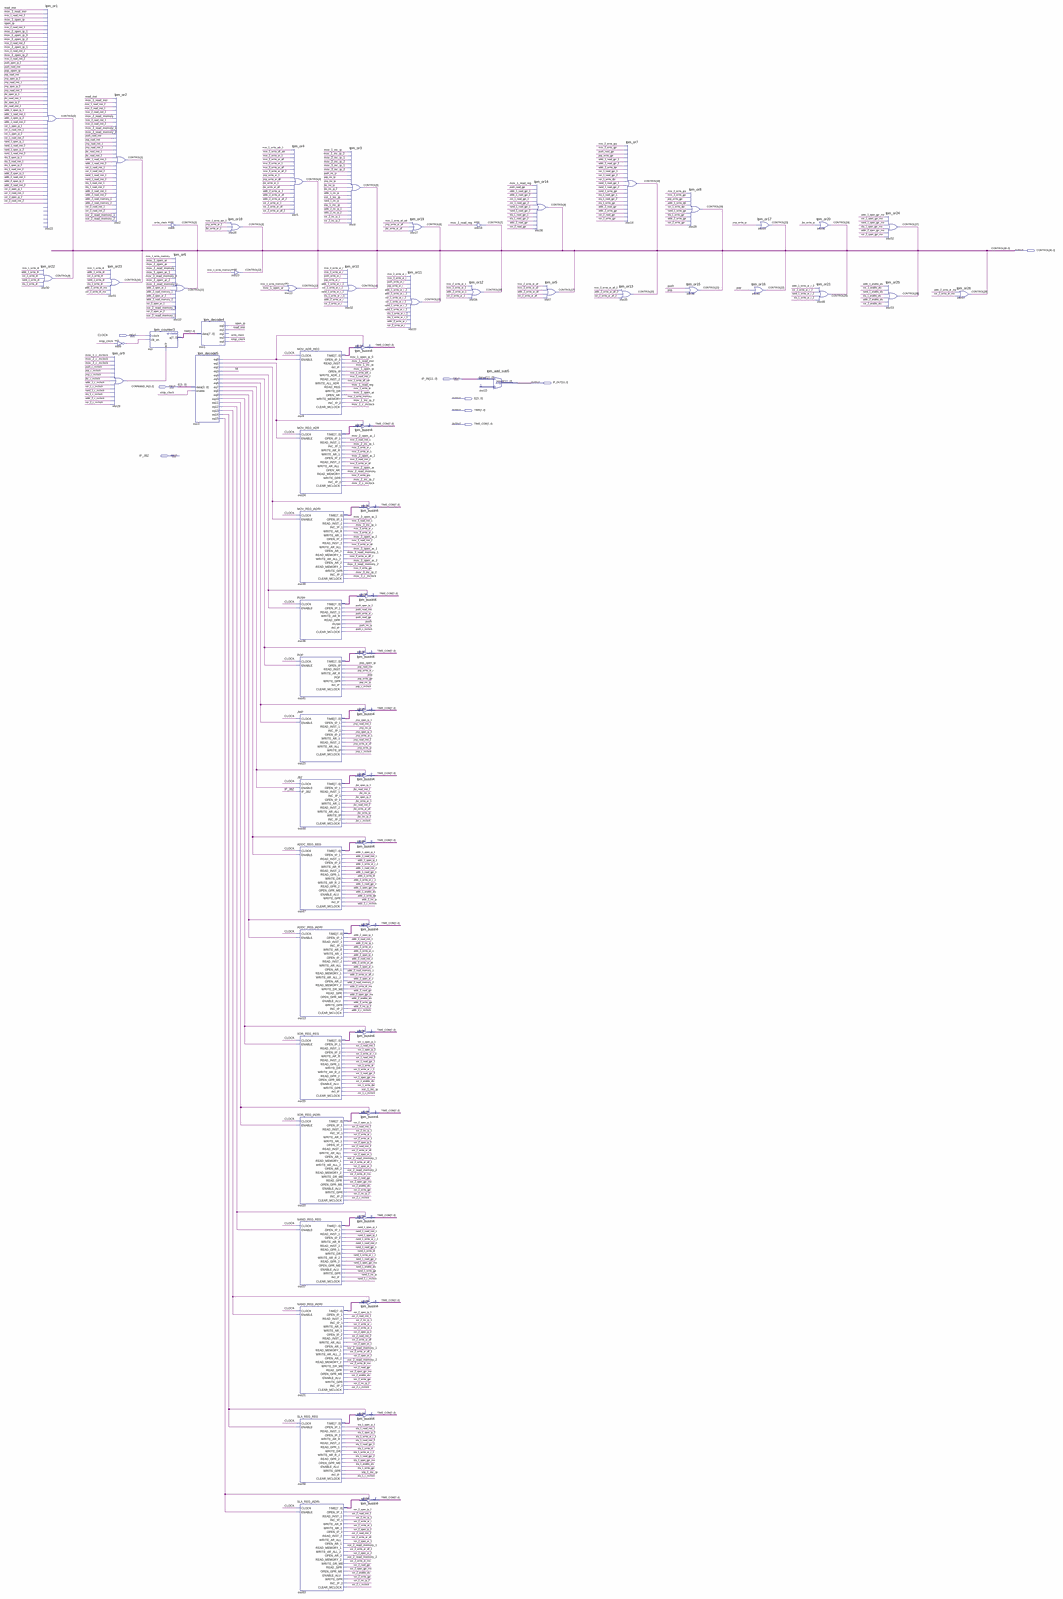
[diagram p0: schematic sheet, whole]
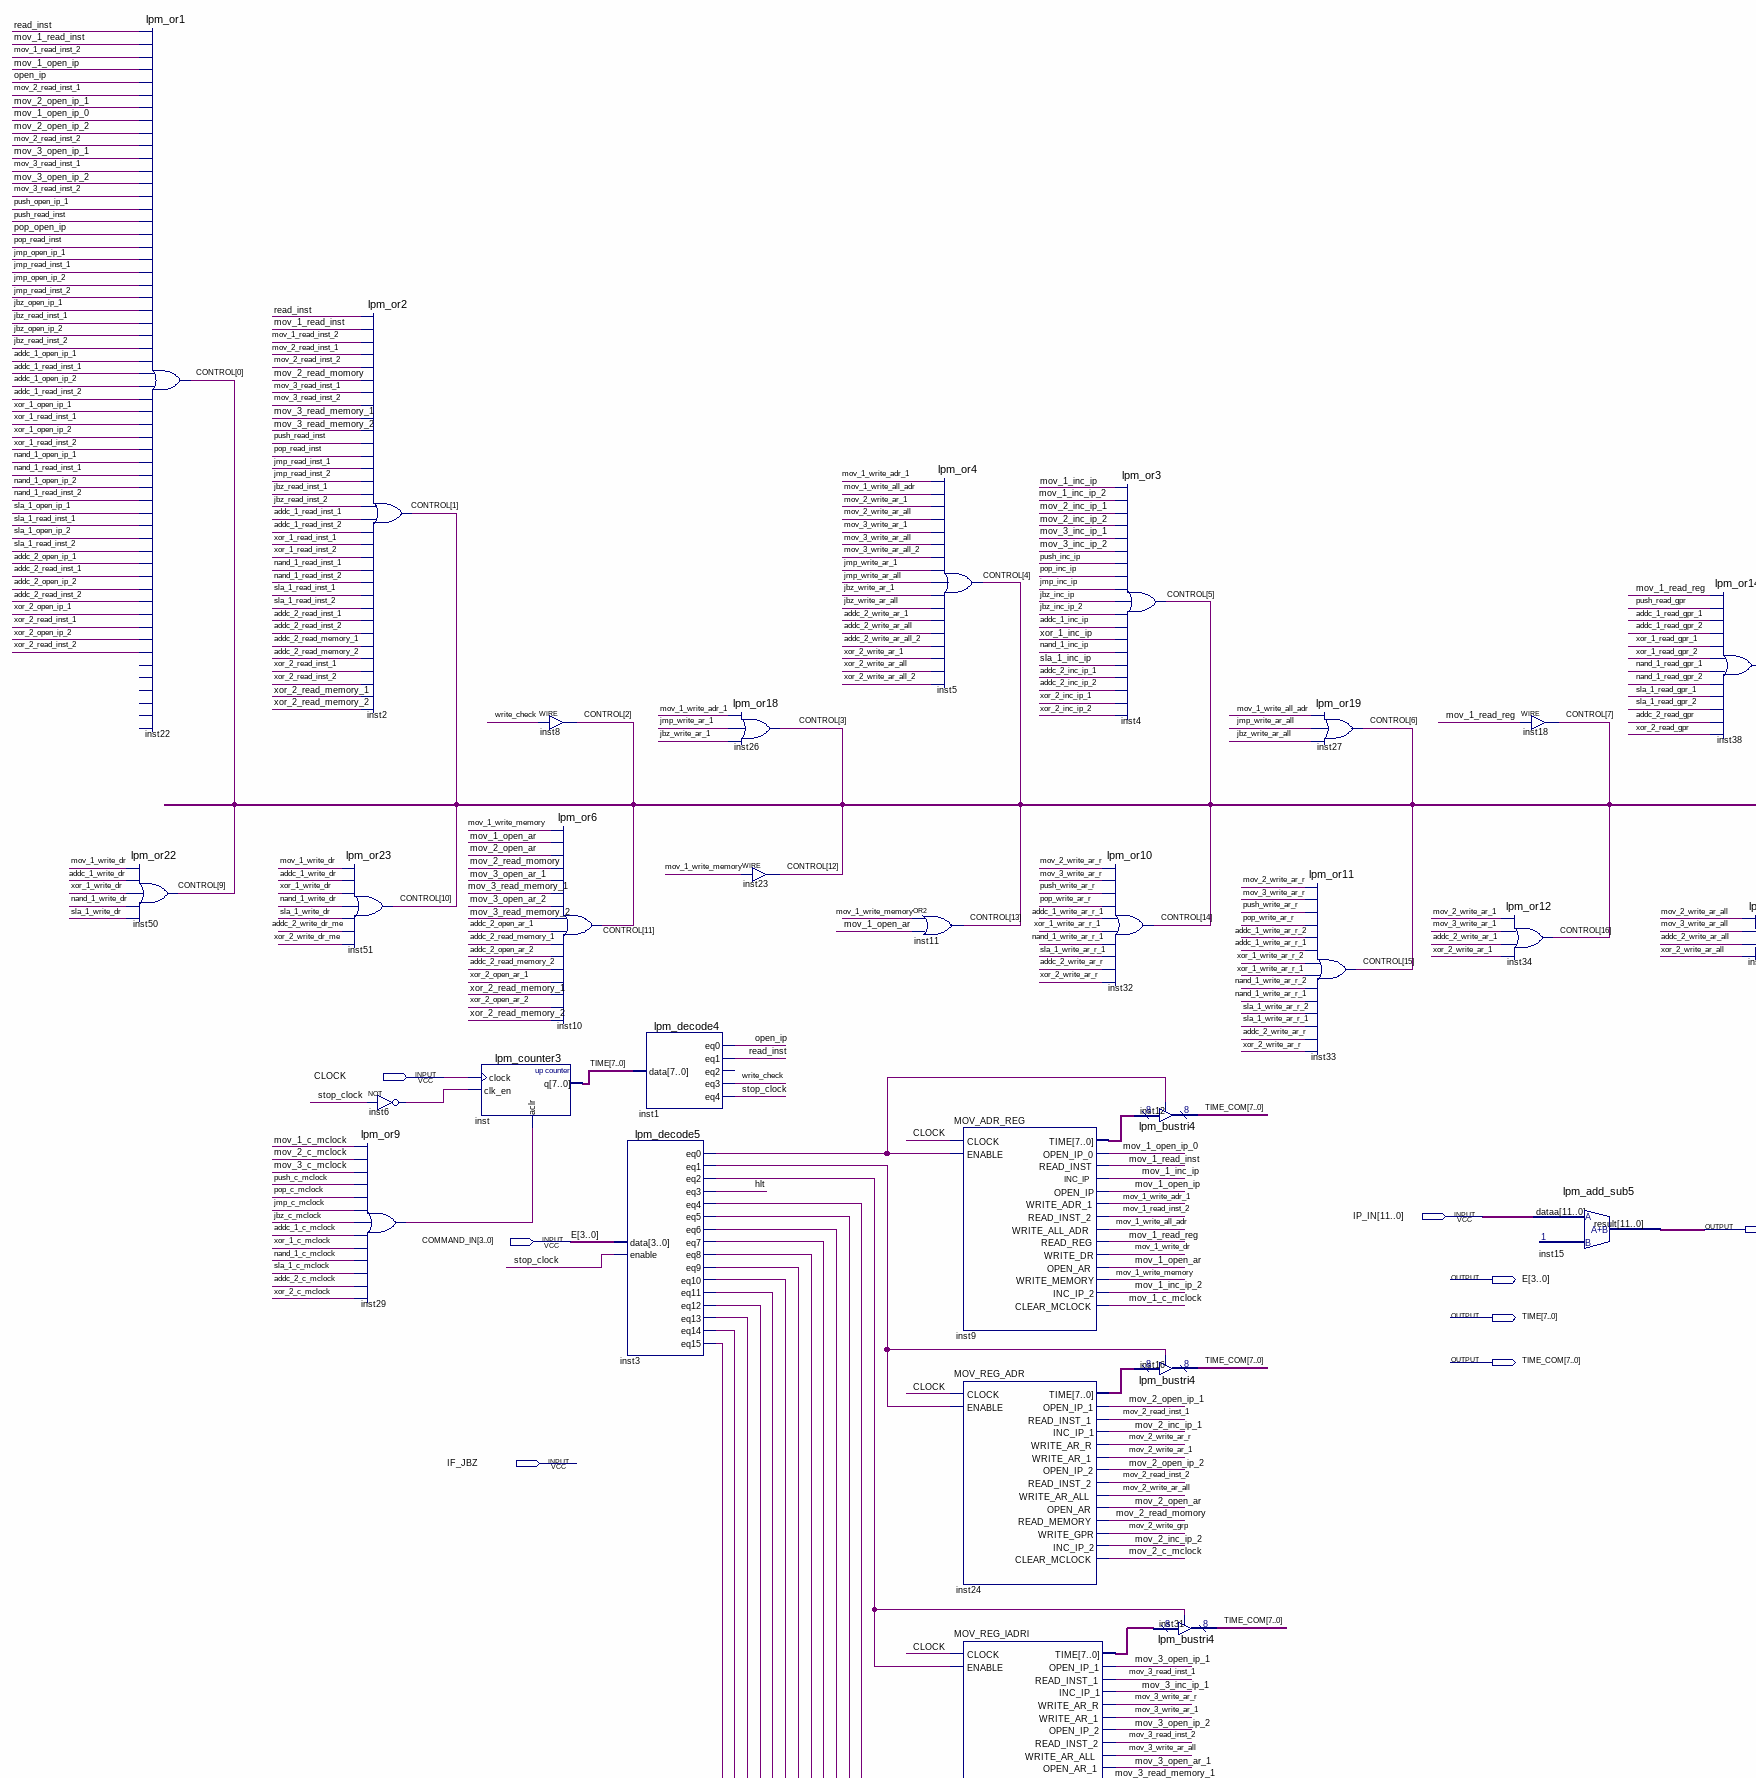
[diagram p1: schematic sheet, upper left part]
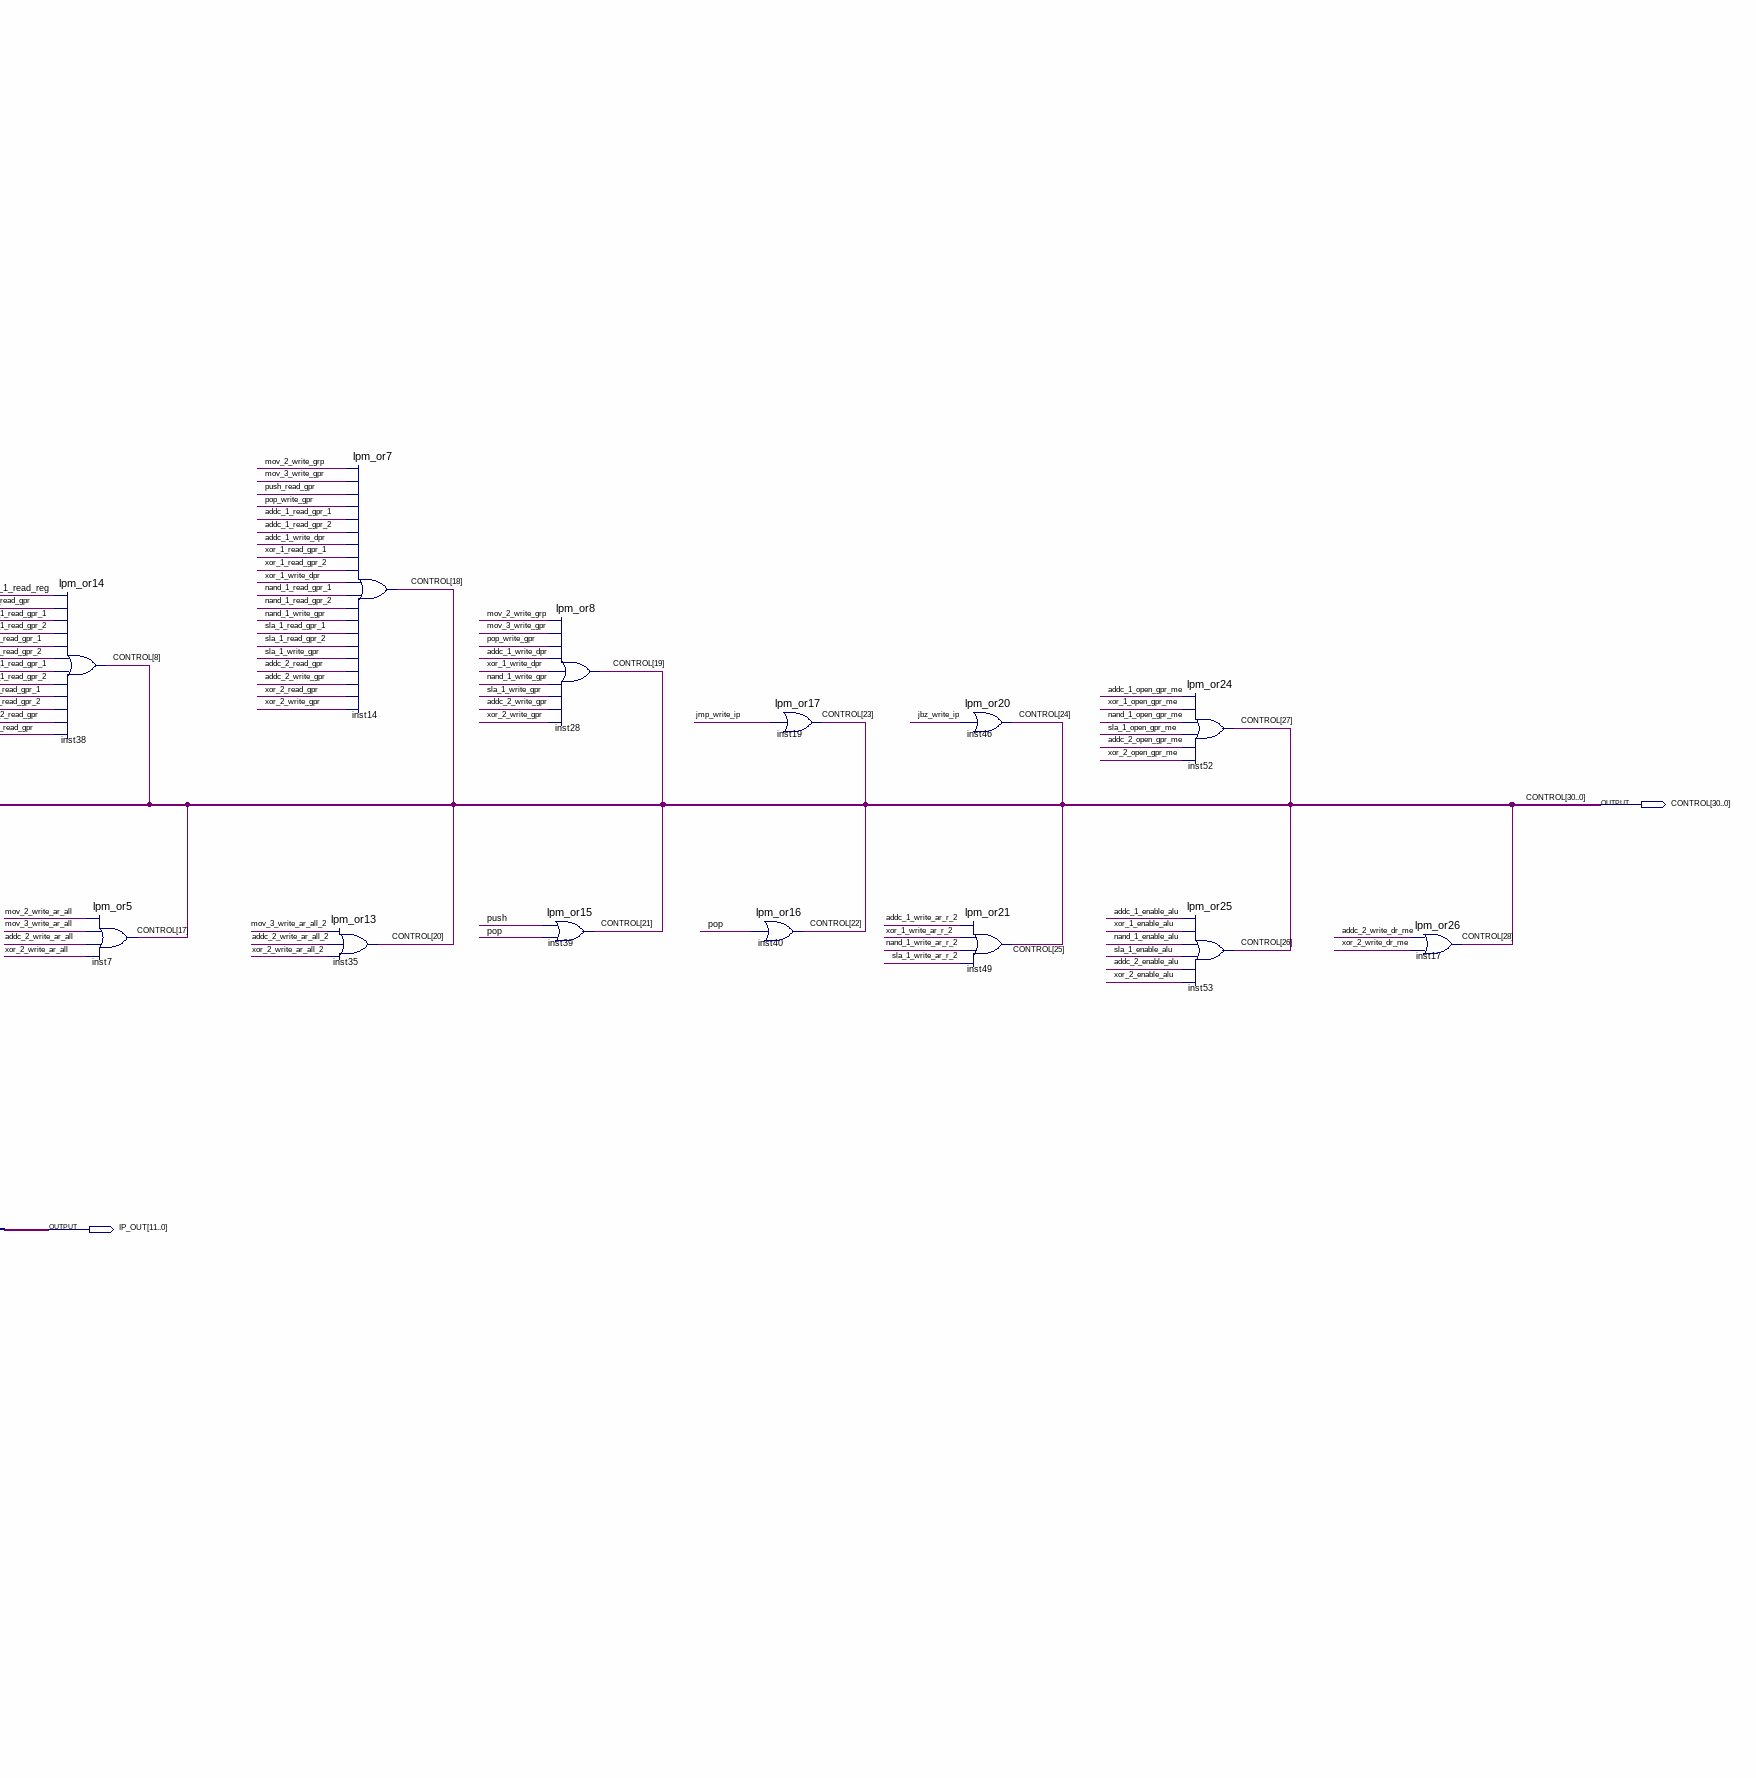
[diagram p2: schematic sheet, upper right part]
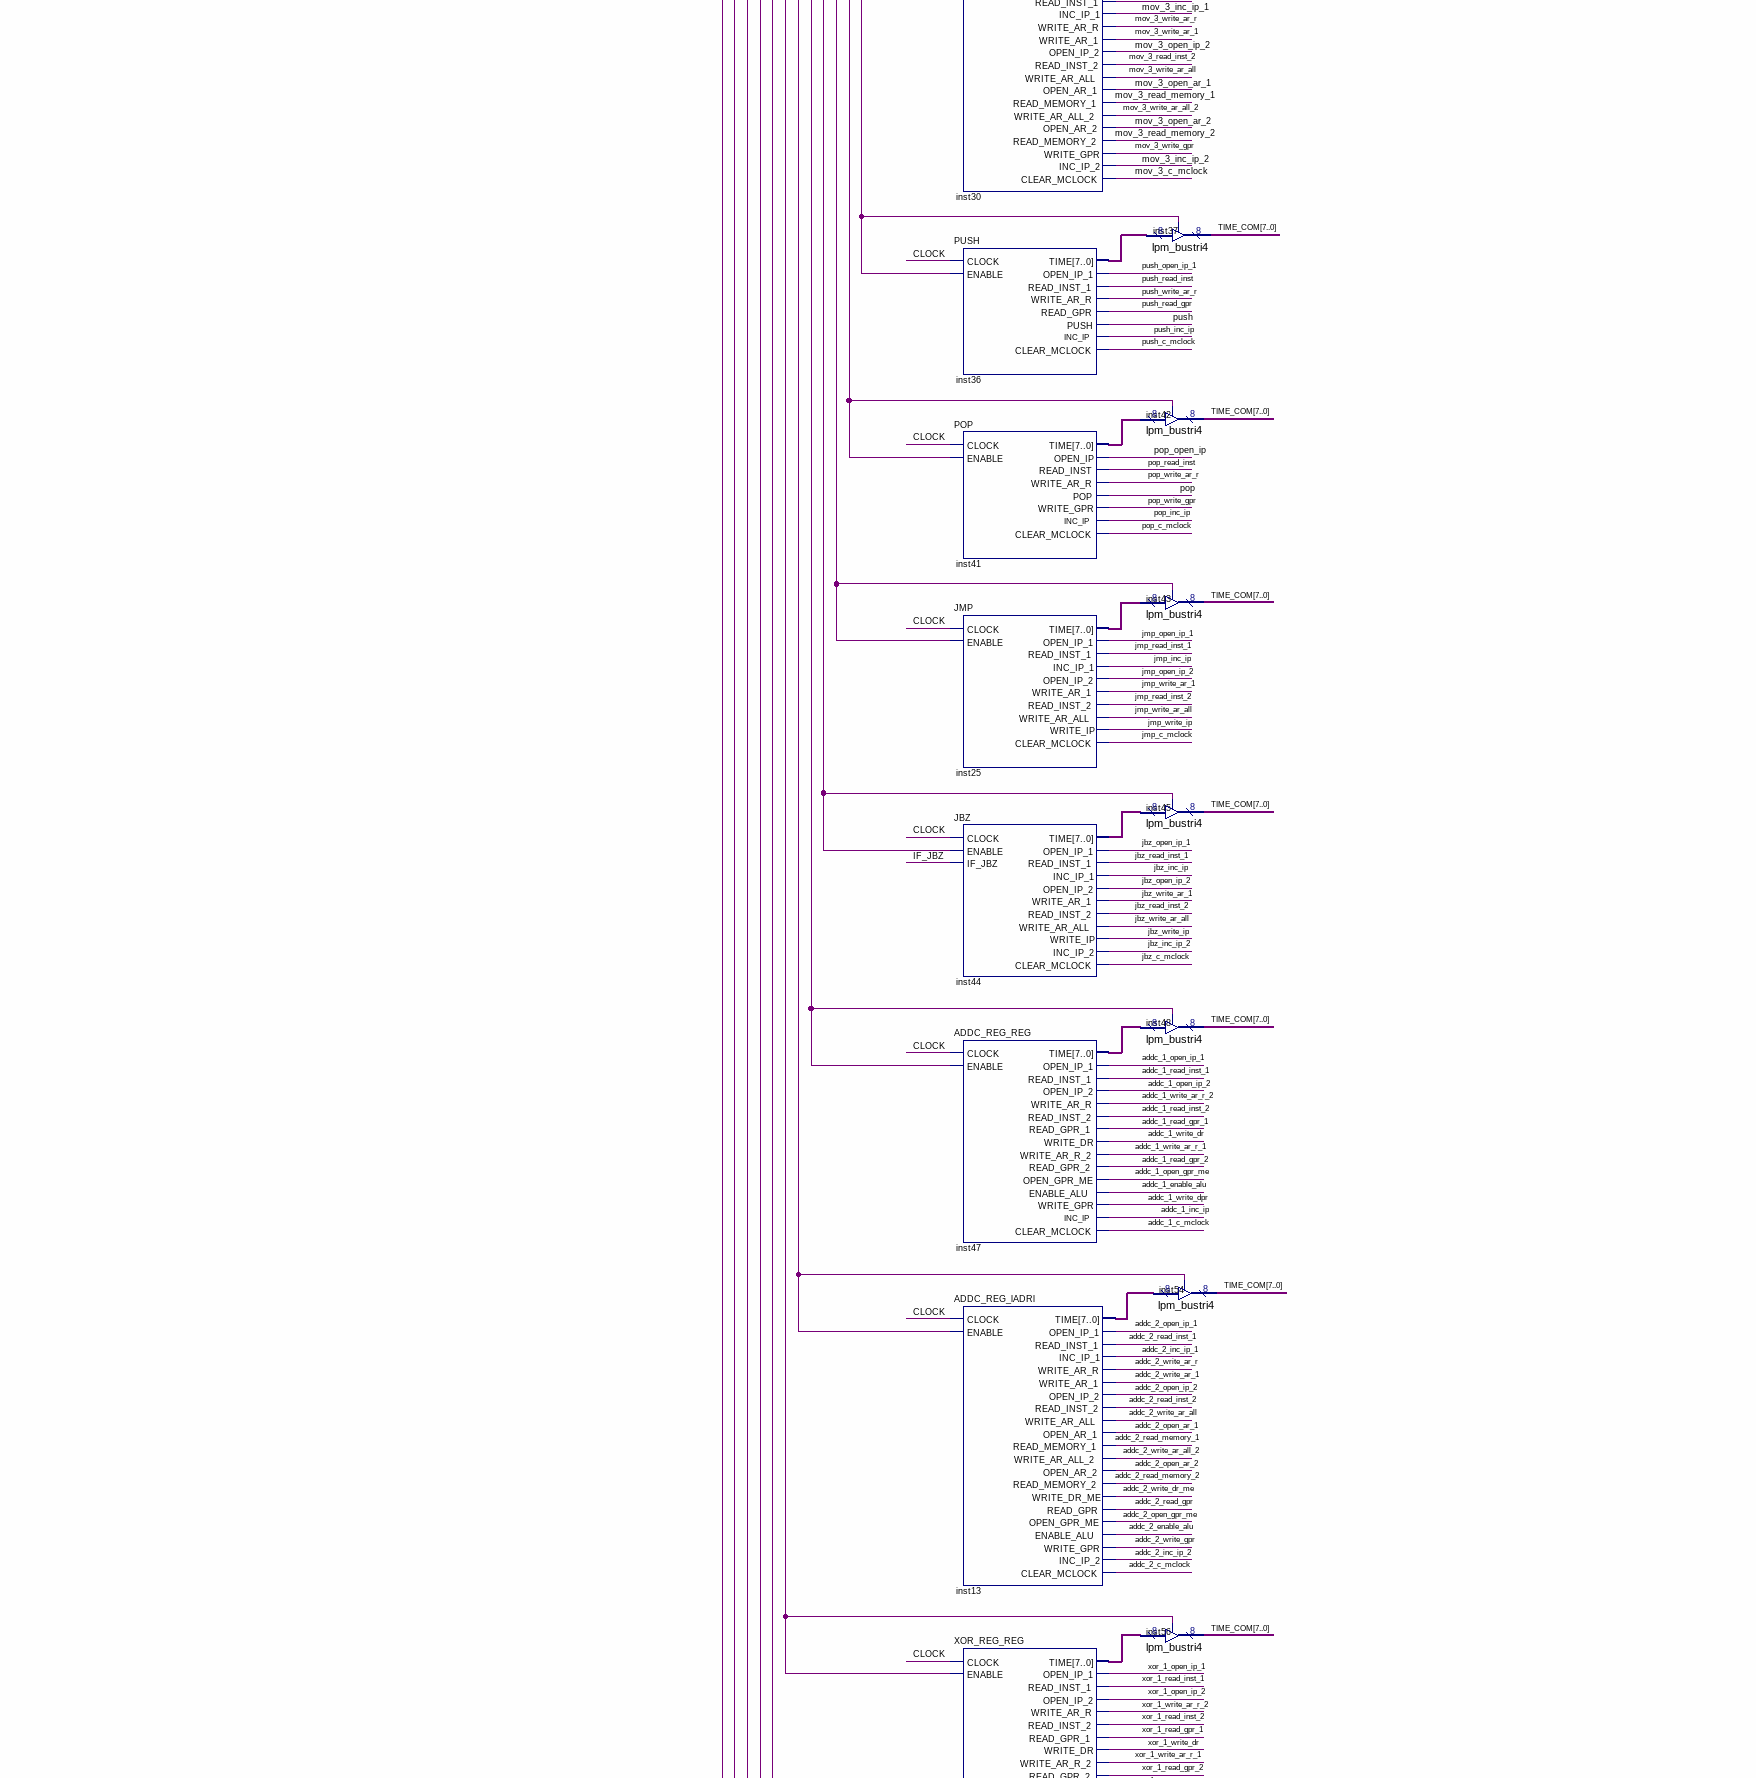
[diagram p3: schematic sheet, middle left part]
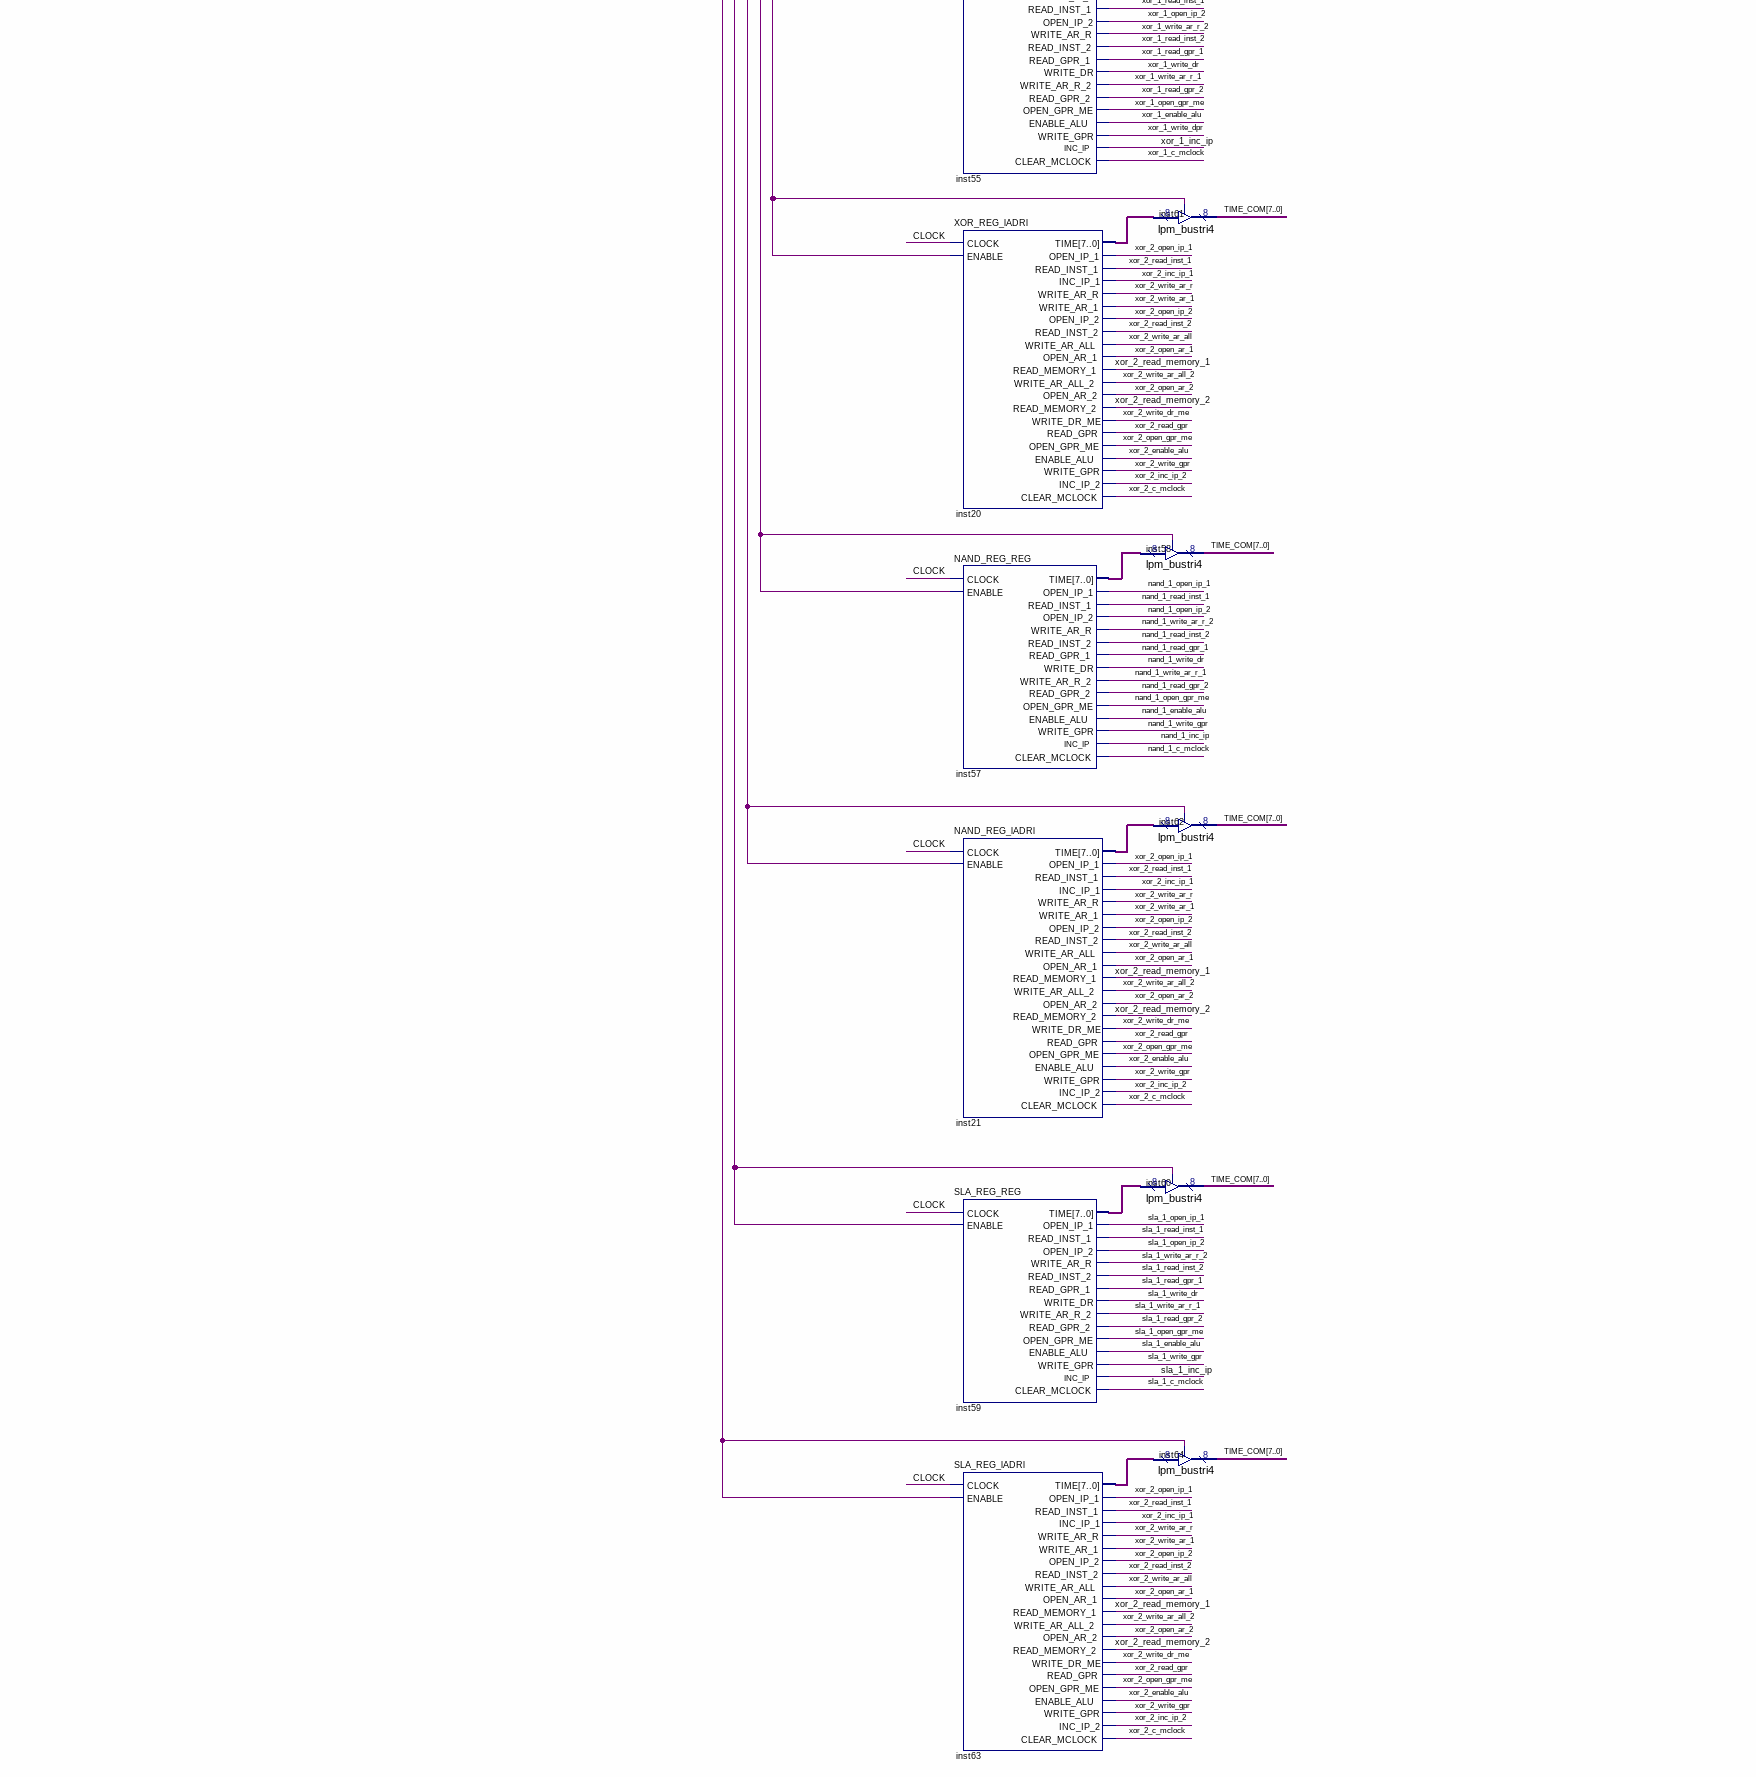
[diagram p4: schematic sheet, lower left part]
// Quartus schematic CU.bdf as structural Verilog: 65 symbols, 9 pins
module CU (
  input  CLOCK,
  input  [11:0] IP_IN,
  input  [3:0] COMMAND_IN,
  input  IF_JBZ,
  output [30:0] CONTROL,
  output [11:0] IP_OUT,
  output [3:0] E,
  output [7:0] TIME,
  output [7:0] TIME_COM
);

  wire addc_1_c_mclock, addc_1_enable_alu, addc_1_inc_ip, addc_1_open_gpr_me, addc_1_open_ip_1,
       addc_1_open_ip_2, addc_1_read_gpr_1, addc_1_read_gpr_2, addc_1_read_inst_1, addc_1_read_inst_2,
       addc_1_write_ar_r_1, addc_1_write_ar_r_2, addc_1_write_dpr, addc_1_write_dr, addc_2_c_mclock,
       addc_2_enable_alu, addc_2_inc_ip_1, addc_2_inc_ip_2, addc_2_open_ar_1, addc_2_open_ar_2,
       addc_2_open_gpr_me, addc_2_open_ip_1, addc_2_open_ip_2, addc_2_read_gpr, addc_2_read_inst_1,
       addc_2_read_inst_2, addc_2_read_memory_1, addc_2_read_memory_2, addc_2_write_ar_1,
       addc_2_write_ar_all, addc_2_write_ar_all_2, addc_2_write_ar_r, addc_2_write_dr_me, addc_2_write_gpr,
       hlt, inst3_eq0, inst3_eq1, inst3_eq2, inst3_eq4, inst3_eq5, inst3_eq6, inst3_eq7, inst3_eq8,
       inst3_eq9, inst3_eq10, inst3_eq11, inst3_eq12, inst3_eq13, inst3_eq14, inst3_eq15, inst6_out,
       inst29_result, jbz_c_mclock, jbz_inc_ip, jbz_inc_ip_2, jbz_open_ip_1, jbz_open_ip_2, jbz_read_inst_1,
       jbz_read_inst_2, jbz_write_ar_1, jbz_write_ar_all, jbz_write_ip, jmp_c_mclock, jmp_inc_ip,
       jmp_open_ip_1, jmp_open_ip_2, jmp_read_inst_1, jmp_read_inst_2, jmp_write_ar_1, jmp_write_ar_all,
       jmp_write_ip, mov_1_c_mclock, mov_1_inc_ip, mov_1_inc_ip_2, mov_1_open_ar, mov_1_open_ip,
       mov_1_open_ip_0, mov_1_read_inst, mov_1_read_inst_2, mov_1_read_reg, mov_1_write_adr_1,
       mov_1_write_all_adr, mov_1_write_dr, mov_1_write_memory, mov_2_c_mclock, mov_2_inc_ip_1,
       mov_2_inc_ip_2, mov_2_open_ar, mov_2_open_ip_1, mov_2_open_ip_2, mov_2_read_inst_1, mov_2_read_inst_2,
       mov_2_read_momory, mov_2_write_ar_1, mov_2_write_ar_all, mov_2_write_ar_r, mov_2_write_grp,
       mov_3_c_mclock, mov_3_inc_ip_1, mov_3_inc_ip_2, mov_3_open_ar_1, mov_3_open_ar_2, mov_3_open_ip_1,
       mov_3_open_ip_2, mov_3_read_inst_1, mov_3_read_inst_2, mov_3_read_memory_1, mov_3_read_memory_2,
       mov_3_write_ar_1, mov_3_write_ar_all, mov_3_write_ar_all_2, mov_3_write_ar_r, mov_3_write_gpr,
       nand_1_c_mclock, nand_1_enable_alu, nand_1_inc_ip, nand_1_open_gpr_me, nand_1_open_ip_1,
       nand_1_open_ip_2, nand_1_read_gpr_1, nand_1_read_gpr_2, nand_1_read_inst_1, nand_1_read_inst_2,
       nand_1_write_ar_r_1, nand_1_write_ar_r_2, nand_1_write_dr, nand_1_write_gpr, open_ip, pop,
       pop_c_mclock, pop_inc_ip, pop_open_ip, pop_read_inst, pop_write_ar_r, pop_write_gpr, push,
       push_c_mclock, push_inc_ip, push_open_ip_1, push_read_gpr, push_read_inst, push_write_ar_r, read_inst,
       sla_1_c_mclock, sla_1_enable_alu, sla_1_inc_ip, sla_1_open_gpr_me, sla_1_open_ip_1, sla_1_open_ip_2,
       sla_1_read_gpr_1, sla_1_read_gpr_2, sla_1_read_inst_1, sla_1_read_inst_2, sla_1_write_ar_r_1,
       sla_1_write_ar_r_2, sla_1_write_dr, sla_1_write_gpr, stop_clock, write_check, xor_1_c_mclock,
       xor_1_enable_alu, xor_1_inc_ip, xor_1_open_gpr_me, xor_1_open_ip_1, xor_1_open_ip_2, xor_1_read_gpr_1,
       xor_1_read_gpr_2, xor_1_read_inst_1, xor_1_read_inst_2, xor_1_write_ar_r_1, xor_1_write_ar_r_2,
       xor_1_write_dpr, xor_1_write_dr, xor_2_c_mclock, xor_2_enable_alu, xor_2_inc_ip_1, xor_2_inc_ip_2,
       xor_2_open_ar_1, xor_2_open_ar_2, xor_2_open_gpr_me, xor_2_open_ip_1, xor_2_open_ip_2, xor_2_read_gpr,
       xor_2_read_inst_1, xor_2_read_inst_2, xor_2_read_memory_1, xor_2_read_memory_2, xor_2_write_ar_1,
       xor_2_write_ar_all, xor_2_write_ar_all_2, xor_2_write_ar_r, xor_2_write_dr_me, xor_2_write_gpr;
  wire [7:0] inst9_time, inst13_time, inst20_time, inst21_time, inst24_time, inst25_time, inst30_time,
       inst36_time, inst41_time, inst44_time, inst47_time, inst55_time, inst57_time, inst59_time, inst63_time;

  lpm_or1 inst22 (
    .data0(read_inst), .data1(mov_1_read_inst), .data2(mov_1_read_inst_2), .data3(mov_1_open_ip),
    .data4(open_ip), .data5(mov_2_read_inst_1), .data6(mov_2_open_ip_1), .data7(mov_1_open_ip_0),
    .data8(mov_2_open_ip_2), .data9(mov_2_read_inst_2), .data10(mov_3_open_ip_1), .data11(mov_3_read_inst_1),
    .data12(mov_3_open_ip_2), .data13(mov_3_read_inst_2), .data14(push_open_ip_1), .data15(push_read_inst),
    .data16(pop_open_ip), .data17(pop_read_inst), .data18(jmp_open_ip_1), .data19(jmp_read_inst_1),
    .data20(jmp_open_ip_2), .data21(jmp_read_inst_2), .data22(jbz_open_ip_1), .data23(jbz_read_inst_1),
    .data24(jbz_open_ip_2), .data25(jbz_read_inst_2), .data26(addc_1_open_ip_1), .data27(addc_1_read_inst_1),
    .data28(addc_1_open_ip_2), .data29(addc_1_read_inst_2), .data30(xor_1_open_ip_1),
    .data31(xor_1_read_inst_1), .data32(xor_1_open_ip_2), .data33(xor_1_read_inst_2),
    .data34(nand_1_open_ip_1), .data35(nand_1_read_inst_1), .data36(nand_1_open_ip_2),
    .data37(nand_1_read_inst_2), .data38(sla_1_open_ip_1), .data39(sla_1_read_inst_1),
    .data40(sla_1_open_ip_2), .data41(sla_1_read_inst_2), .data42(addc_2_open_ip_1),
    .data43(addc_2_read_inst_1), .data44(addc_2_open_ip_2), .data45(addc_2_read_inst_2),
    .data46(xor_2_open_ip_1), .data47(xor_2_read_inst_1), .data48(xor_2_open_ip_2),
    .data49(xor_2_read_inst_2), .result(CONTROL[0]));  // open: data50, data51, data52, data53, data54, data55
  lpm_or22 inst50 (
    .data0(mov_1_write_dr), .data1(addc_1_write_dr), .data2(xor_1_write_dr), .data3(nand_1_write_dr),
    .data4(sla_1_write_dr), .result(CONTROL[9]));
  lpm_or2 inst2 (
    .data0(read_inst), .data1(mov_1_read_inst), .data2(mov_1_read_inst_2), .data3(mov_2_read_inst_1),
    .data4(mov_2_read_inst_2), .data5(mov_2_read_momory), .data6(mov_3_read_inst_1),
    .data7(mov_3_read_inst_2), .data8(mov_3_read_memory_1), .data9(mov_3_read_memory_2),
    .data10(push_read_inst), .data11(pop_read_inst), .data12(jmp_read_inst_1), .data13(jmp_read_inst_2),
    .data14(jbz_read_inst_1), .data15(jbz_read_inst_2), .data16(addc_1_read_inst_1),
    .data17(addc_1_read_inst_2), .data18(xor_1_read_inst_1), .data19(xor_1_read_inst_2),
    .data20(nand_1_read_inst_1), .data21(nand_1_read_inst_2), .data22(sla_1_read_inst_1),
    .data23(sla_1_read_inst_2), .data24(addc_2_read_inst_1), .data25(addc_2_read_inst_2),
    .data26(addc_2_read_memory_1), .data27(addc_2_read_memory_2), .data28(xor_2_read_inst_1),
    .data29(xor_2_read_inst_2), .data30(xor_2_read_memory_1), .data31(xor_2_read_memory_2),
    .result(CONTROL[1]));
  lpm_or23 inst51 (
    .data0(mov_1_write_dr), .data1(addc_1_write_dr), .data2(xor_1_write_dr), .data3(nand_1_write_dr),
    .data4(sla_1_write_dr), .data5(addc_2_write_dr_me), .data6(xor_2_write_dr_me), .result(CONTROL[10]));
  not inst6 (inst6_out, stop_clock);
  lpm_or9 inst29 (
    .data0(mov_1_c_mclock), .data1(mov_2_c_mclock), .data2(mov_3_c_mclock), .data3(push_c_mclock),
    .data4(pop_c_mclock), .data5(jmp_c_mclock), .data6(jbz_c_mclock), .data7(addc_1_c_mclock),
    .data8(xor_1_c_mclock), .data9(nand_1_c_mclock), .data10(sla_1_c_mclock), .data11(addc_2_c_mclock),
    .data12(xor_2_c_mclock), .result(inst29_result));
  lpm_counter3 inst (.clock(CLOCK), .clk_en(inst6_out), .aclr(inst29_result), .q(TIME));
  assign CONTROL[2] = write_check;  // WIRE inst8
  lpm_or6 inst10 (
    .data0(mov_1_write_memory), .data1(mov_1_open_ar), .data2(mov_2_open_ar), .data3(mov_2_read_momory),
    .data4(mov_3_open_ar_1), .data5(mov_3_read_memory_1), .data6(mov_3_open_ar_2),
    .data7(mov_3_read_memory_2), .data8(addc_2_open_ar_1), .data9(addc_2_read_memory_1),
    .data10(addc_2_open_ar_2), .data11(addc_2_read_memory_2), .data12(xor_2_open_ar_1),
    .data13(xor_2_read_memory_1), .data14(xor_2_open_ar_2), .data15(xor_2_read_memory_2), .result(CONTROL[11]));
  lpm_decode5 inst3 (
    .data(COMMAND_IN), .enable(stop_clock), .eq0(inst3_eq0), .eq1(inst3_eq1), .eq2(inst3_eq2), .eq3(hlt),
    .eq4(inst3_eq4), .eq5(inst3_eq5), .eq6(inst3_eq6), .eq7(inst3_eq7), .eq8(inst3_eq8), .eq9(inst3_eq9),
    .eq10(inst3_eq10), .eq11(inst3_eq11), .eq12(inst3_eq12), .eq13(inst3_eq13), .eq14(inst3_eq14),
    .eq15(inst3_eq15));
  lpm_decode4 inst1 (.data(TIME), .eq0(open_ip), .eq1(read_inst), .eq3(write_check), .eq4(stop_clock));  // open: eq2
  lpm_or18 inst26 (.data0(mov_1_write_adr_1), .data1(jmp_write_ar_1), .data2(jbz_write_ar_1), .result(CONTROL[3]));
  assign CONTROL[12] = mov_1_write_memory;  // WIRE inst23
  lpm_or4 inst5 (
    .data0(mov_1_write_adr_1), .data1(mov_1_write_all_adr), .data2(mov_2_write_ar_1),
    .data3(mov_2_write_ar_all), .data4(mov_3_write_ar_1), .data5(mov_3_write_ar_all),
    .data6(mov_3_write_ar_all_2), .data7(jmp_write_ar_1), .data8(jmp_write_ar_all), .data9(jbz_write_ar_1),
    .data10(jbz_write_ar_all), .data11(addc_2_write_ar_1), .data12(addc_2_write_ar_all),
    .data13(addc_2_write_ar_all_2), .data14(xor_2_write_ar_1), .data15(xor_2_write_ar_all),
    .data16(xor_2_write_ar_all_2), .result(CONTROL[4]));
  or inst11 (CONTROL[13], mov_1_write_memory, mov_1_open_ar);
  MOV_ADR_REG inst9 (
    .CLOCK(CLOCK), .ENABLE(inst3_eq0), .TIME(inst9_time), .OPEN_IP_0(mov_1_open_ip_0),
    .READ_INST(mov_1_read_inst), .INC_IP(mov_1_inc_ip), .OPEN_IP(mov_1_open_ip),
    .WRITE_ADR_1(mov_1_write_adr_1), .READ_INST_2(mov_1_read_inst_2), .WRITE_ALL_ADR(mov_1_write_all_adr),
    .READ_REG(mov_1_read_reg), .WRITE_DR(mov_1_write_dr), .OPEN_AR(mov_1_open_ar),
    .WRITE_MEMORY(mov_1_write_memory), .INC_IP_2(mov_1_inc_ip_2), .CLEAR_MCLOCK(mov_1_c_mclock));
  MOV_REG_ADR inst24 (
    .CLOCK(CLOCK), .ENABLE(inst3_eq1), .TIME(inst24_time), .OPEN_IP_1(mov_2_open_ip_1),
    .READ_INST_1(mov_2_read_inst_1), .INC_IP_1(mov_2_inc_ip_1), .WRITE_AR_R(mov_2_write_ar_r),
    .WRITE_AR_1(mov_2_write_ar_1), .OPEN_IP_2(mov_2_open_ip_2), .READ_INST_2(mov_2_read_inst_2),
    .WRITE_AR_ALL(mov_2_write_ar_all), .OPEN_AR(mov_2_open_ar), .READ_MEMORY(mov_2_read_momory),
    .WRITE_GPR(mov_2_write_grp), .INC_IP_2(mov_2_inc_ip_2), .CLEAR_MCLOCK(mov_2_c_mclock));
  MOV_REG_lADRl inst30 (
    .CLOCK(CLOCK), .ENABLE(inst3_eq2), .TIME(inst30_time), .OPEN_IP_1(mov_3_open_ip_1),
    .READ_INST_1(mov_3_read_inst_1), .INC_IP_1(mov_3_inc_ip_1), .WRITE_AR_R(mov_3_write_ar_r),
    .WRITE_AR_1(mov_3_write_ar_1), .OPEN_IP_2(mov_3_open_ip_2), .READ_INST_2(mov_3_read_inst_2),
    .WRITE_AR_ALL(mov_3_write_ar_all), .OPEN_AR_1(mov_3_open_ar_1), .READ_MEMORY_1(mov_3_read_memory_1),
    .WRITE_AR_ALL_2(mov_3_write_ar_all_2), .OPEN_AR_2(mov_3_open_ar_2), .READ_MEMORY_2(mov_3_read_memory_2),
    .WRITE_GPR(mov_3_write_gpr), .INC_IP_2(mov_3_inc_ip_2), .CLEAR_MCLOCK(mov_3_c_mclock));
  PUSH inst36 (
    .CLOCK(CLOCK), .ENABLE(inst3_eq4), .TIME(inst36_time), .OPEN_IP_1(push_open_ip_1),
    .READ_INST_1(push_read_inst), .WRITE_AR_R(push_write_ar_r), .READ_GPR(push_read_gpr), .PUSH(push),
    .INC_IP(push_inc_ip), .CLEAR_MCLOCK(push_c_mclock));
  POP inst41 (
    .CLOCK(CLOCK), .ENABLE(inst3_eq5), .TIME(inst41_time), .OPEN_IP(pop_open_ip), .READ_INST(pop_read_inst),
    .WRITE_AR_R(pop_write_ar_r), .POP(pop), .WRITE_GPR(pop_write_gpr), .INC_IP(pop_inc_ip),
    .CLEAR_MCLOCK(pop_c_mclock));
  JMP inst25 (
    .CLOCK(CLOCK), .ENABLE(inst3_eq6), .TIME(inst25_time), .OPEN_IP_1(jmp_open_ip_1),
    .READ_INST_1(jmp_read_inst_1), .INC_IP_1(jmp_inc_ip), .OPEN_IP_2(jmp_open_ip_2),
    .WRITE_AR_1(jmp_write_ar_1), .READ_INST_2(jmp_read_inst_2), .WRITE_AR_ALL(jmp_write_ar_all),
    .WRITE_IP(jmp_write_ip), .CLEAR_MCLOCK(jmp_c_mclock));
  JBZ inst44 (
    .CLOCK(CLOCK), .ENABLE(inst3_eq7), .IF_JBZ(IF_JBZ), .TIME(inst44_time), .OPEN_IP_1(jbz_open_ip_1),
    .READ_INST_1(jbz_read_inst_1), .INC_IP_1(jbz_inc_ip), .OPEN_IP_2(jbz_open_ip_2),
    .WRITE_AR_1(jbz_write_ar_1), .READ_INST_2(jbz_read_inst_2), .WRITE_AR_ALL(jbz_write_ar_all),
    .WRITE_IP(jbz_write_ip), .INC_IP_2(jbz_inc_ip_2), .CLEAR_MCLOCK(jbz_c_mclock));
  ADDC_REG_REG inst47 (
    .CLOCK(CLOCK), .ENABLE(inst3_eq8), .TIME(inst47_time), .OPEN_IP_1(addc_1_open_ip_1),
    .READ_INST_1(addc_1_read_inst_1), .OPEN_IP_2(addc_1_open_ip_2), .WRITE_AR_R(addc_1_write_ar_r_2),
    .READ_INST_2(addc_1_read_inst_2), .READ_GPR_1(addc_1_read_gpr_1), .WRITE_DR(addc_1_write_dr),
    .WRITE_AR_R_2(addc_1_write_ar_r_1), .READ_GPR_2(addc_1_read_gpr_2), .OPEN_GPR_ME(addc_1_open_gpr_me),
    .ENABLE_ALU(addc_1_enable_alu), .WRITE_GPR(addc_1_write_dpr), .INC_IP(addc_1_inc_ip),
    .CLEAR_MCLOCK(addc_1_c_mclock));
  ADDC_REG_lADRl inst13 (
    .CLOCK(CLOCK), .ENABLE(inst3_eq9), .TIME(inst13_time), .OPEN_IP_1(addc_2_open_ip_1),
    .READ_INST_1(addc_2_read_inst_1), .INC_IP_1(addc_2_inc_ip_1), .WRITE_AR_R(addc_2_write_ar_r),
    .WRITE_AR_1(addc_2_write_ar_1), .OPEN_IP_2(addc_2_open_ip_2), .READ_INST_2(addc_2_read_inst_2),
    .WRITE_AR_ALL(addc_2_write_ar_all), .OPEN_AR_1(addc_2_open_ar_1), .READ_MEMORY_1(addc_2_read_memory_1),
    .WRITE_AR_ALL_2(addc_2_write_ar_all_2), .OPEN_AR_2(addc_2_open_ar_2),
    .READ_MEMORY_2(addc_2_read_memory_2), .WRITE_DR_ME(addc_2_write_dr_me), .READ_GPR(addc_2_read_gpr),
    .OPEN_GPR_ME(addc_2_open_gpr_me), .ENABLE_ALU(addc_2_enable_alu), .WRITE_GPR(addc_2_write_gpr),
    .INC_IP_2(addc_2_inc_ip_2), .CLEAR_MCLOCK(addc_2_c_mclock));
  XOR_REG_REG inst55 (
    .CLOCK(CLOCK), .ENABLE(inst3_eq10), .TIME(inst55_time), .OPEN_IP_1(xor_1_open_ip_1),
    .READ_INST_1(xor_1_read_inst_1), .OPEN_IP_2(xor_1_open_ip_2), .WRITE_AR_R(xor_1_write_ar_r_2),
    .READ_INST_2(xor_1_read_inst_2), .READ_GPR_1(xor_1_read_gpr_1), .WRITE_DR(xor_1_write_dr),
    .WRITE_AR_R_2(xor_1_write_ar_r_1), .READ_GPR_2(xor_1_read_gpr_2), .OPEN_GPR_ME(xor_1_open_gpr_me),
    .ENABLE_ALU(xor_1_enable_alu), .WRITE_GPR(xor_1_write_dpr), .INC_IP(xor_1_inc_ip),
    .CLEAR_MCLOCK(xor_1_c_mclock));
  XOR_REG_lADRl inst20 (
    .CLOCK(CLOCK), .ENABLE(inst3_eq11), .TIME(inst20_time), .OPEN_IP_1(xor_2_open_ip_1),
    .READ_INST_1(xor_2_read_inst_1), .INC_IP_1(xor_2_inc_ip_1), .WRITE_AR_R(xor_2_write_ar_r),
    .WRITE_AR_1(xor_2_write_ar_1), .OPEN_IP_2(xor_2_open_ip_2), .READ_INST_2(xor_2_read_inst_2),
    .WRITE_AR_ALL(xor_2_write_ar_all), .OPEN_AR_1(xor_2_open_ar_1), .READ_MEMORY_1(xor_2_read_memory_1),
    .WRITE_AR_ALL_2(xor_2_write_ar_all_2), .OPEN_AR_2(xor_2_open_ar_2), .READ_MEMORY_2(xor_2_read_memory_2),
    .WRITE_DR_ME(xor_2_write_dr_me), .READ_GPR(xor_2_read_gpr), .OPEN_GPR_ME(xor_2_open_gpr_me),
    .ENABLE_ALU(xor_2_enable_alu), .WRITE_GPR(xor_2_write_gpr), .INC_IP_2(xor_2_inc_ip_2),
    .CLEAR_MCLOCK(xor_2_c_mclock));
  NAND_REG_REG inst57 (
    .CLOCK(CLOCK), .ENABLE(inst3_eq12), .TIME(inst57_time), .OPEN_IP_1(nand_1_open_ip_1),
    .READ_INST_1(nand_1_read_inst_1), .OPEN_IP_2(nand_1_open_ip_2), .WRITE_AR_R(nand_1_write_ar_r_2),
    .READ_INST_2(nand_1_read_inst_2), .READ_GPR_1(nand_1_read_gpr_1), .WRITE_DR(nand_1_write_dr),
    .WRITE_AR_R_2(nand_1_write_ar_r_1), .READ_GPR_2(nand_1_read_gpr_2), .OPEN_GPR_ME(nand_1_open_gpr_me),
    .ENABLE_ALU(nand_1_enable_alu), .WRITE_GPR(nand_1_write_gpr), .INC_IP(nand_1_inc_ip),
    .CLEAR_MCLOCK(nand_1_c_mclock));
  NAND_REG_lADRl inst21 (
    .CLOCK(CLOCK), .ENABLE(inst3_eq13), .TIME(inst21_time), .OPEN_IP_1(xor_2_open_ip_1),
    .READ_INST_1(xor_2_read_inst_1), .INC_IP_1(xor_2_inc_ip_1), .WRITE_AR_R(xor_2_write_ar_r),
    .WRITE_AR_1(xor_2_write_ar_1), .OPEN_IP_2(xor_2_open_ip_2), .READ_INST_2(xor_2_read_inst_2),
    .WRITE_AR_ALL(xor_2_write_ar_all), .OPEN_AR_1(xor_2_open_ar_1), .READ_MEMORY_1(xor_2_read_memory_1),
    .WRITE_AR_ALL_2(xor_2_write_ar_all_2), .OPEN_AR_2(xor_2_open_ar_2), .READ_MEMORY_2(xor_2_read_memory_2),
    .WRITE_DR_ME(xor_2_write_dr_me), .READ_GPR(xor_2_read_gpr), .OPEN_GPR_ME(xor_2_open_gpr_me),
    .ENABLE_ALU(xor_2_enable_alu), .WRITE_GPR(xor_2_write_gpr), .INC_IP_2(xor_2_inc_ip_2),
    .CLEAR_MCLOCK(xor_2_c_mclock));
  SLA_REG_REG inst59 (
    .CLOCK(CLOCK), .ENABLE(inst3_eq14), .TIME(inst59_time), .OPEN_IP_1(sla_1_open_ip_1),
    .READ_INST_1(sla_1_read_inst_1), .OPEN_IP_2(sla_1_open_ip_2), .WRITE_AR_R(sla_1_write_ar_r_2),
    .READ_INST_2(sla_1_read_inst_2), .READ_GPR_1(sla_1_read_gpr_1), .WRITE_DR(sla_1_write_dr),
    .WRITE_AR_R_2(sla_1_write_ar_r_1), .READ_GPR_2(sla_1_read_gpr_2), .OPEN_GPR_ME(sla_1_open_gpr_me),
    .ENABLE_ALU(sla_1_enable_alu), .WRITE_GPR(sla_1_write_gpr), .INC_IP(sla_1_inc_ip),
    .CLEAR_MCLOCK(sla_1_c_mclock));
  SLA_REG_lADRl inst63 (
    .CLOCK(CLOCK), .ENABLE(inst3_eq15), .TIME(inst63_time), .OPEN_IP_1(xor_2_open_ip_1),
    .READ_INST_1(xor_2_read_inst_1), .INC_IP_1(xor_2_inc_ip_1), .WRITE_AR_R(xor_2_write_ar_r),
    .WRITE_AR_1(xor_2_write_ar_1), .OPEN_IP_2(xor_2_open_ip_2), .READ_INST_2(xor_2_read_inst_2),
    .WRITE_AR_ALL(xor_2_write_ar_all), .OPEN_AR_1(xor_2_open_ar_1), .READ_MEMORY_1(xor_2_read_memory_1),
    .WRITE_AR_ALL_2(xor_2_write_ar_all_2), .OPEN_AR_2(xor_2_open_ar_2), .READ_MEMORY_2(xor_2_read_memory_2),
    .WRITE_DR_ME(xor_2_write_dr_me), .READ_GPR(xor_2_read_gpr), .OPEN_GPR_ME(xor_2_open_gpr_me),
    .ENABLE_ALU(xor_2_enable_alu), .WRITE_GPR(xor_2_write_gpr), .INC_IP_2(xor_2_inc_ip_2),
    .CLEAR_MCLOCK(xor_2_c_mclock));
  lpm_or3 inst4 (
    .data0(mov_1_inc_ip), .data1(mov_1_inc_ip_2), .data2(mov_2_inc_ip_1), .data3(mov_2_inc_ip_2),
    .data4(mov_3_inc_ip_1), .data5(mov_3_inc_ip_2), .data6(push_inc_ip), .data7(pop_inc_ip),
    .data8(jmp_inc_ip), .data9(jbz_inc_ip), .data10(jbz_inc_ip_2), .data11(addc_1_inc_ip),
    .data12(xor_1_inc_ip), .data13(nand_1_inc_ip), .data14(sla_1_inc_ip), .data15(addc_2_inc_ip_1),
    .data16(addc_2_inc_ip_2), .data17(xor_2_inc_ip_1), .data18(xor_2_inc_ip_2), .result(CONTROL[5]));
  lpm_or10 inst32 (
    .data0(mov_2_write_ar_r), .data1(mov_3_write_ar_r), .data2(push_write_ar_r), .data3(pop_write_ar_r),
    .data4(addc_1_write_ar_r_1), .data5(xor_1_write_ar_r_1), .data6(nand_1_write_ar_r_1),
    .data7(sla_1_write_ar_r_1), .data8(addc_2_write_ar_r), .data9(xor_2_write_ar_r), .result(CONTROL[14]));
  lpm_bustri4 inst12 (.enabledt(inst3_eq0), .data(inst9_time), .tridata(TIME_COM));
  lpm_bustri4 inst16 (.enabledt(inst3_eq1), .data(inst24_time), .tridata(TIME_COM));
  lpm_bustri4 inst31 (.enabledt(inst3_eq2), .data(inst30_time), .tridata(TIME_COM));
  lpm_bustri4 inst37 (.enabledt(inst3_eq4), .data(inst36_time), .tridata(TIME_COM));
  lpm_bustri4 inst42 (.enabledt(inst3_eq5), .data(inst41_time), .tridata(TIME_COM));
  lpm_bustri4 inst43 (.enabledt(inst3_eq6), .data(inst25_time), .tridata(TIME_COM));
  lpm_bustri4 inst45 (.enabledt(inst3_eq7), .data(inst44_time), .tridata(TIME_COM));
  lpm_bustri4 inst48 (.enabledt(inst3_eq8), .data(inst47_time), .tridata(TIME_COM));
  lpm_bustri4 inst54 (.enabledt(inst3_eq9), .data(inst13_time), .tridata(TIME_COM));
  lpm_bustri4 inst56 (.enabledt(inst3_eq10), .data(inst55_time), .tridata(TIME_COM));
  lpm_bustri4 inst61 (.enabledt(inst3_eq11), .data(inst20_time), .tridata(TIME_COM));
  lpm_bustri4 inst58 (.enabledt(inst3_eq12), .data(inst57_time), .tridata(TIME_COM));
  lpm_bustri4 inst62 (.enabledt(inst3_eq13), .data(inst21_time), .tridata(TIME_COM));
  lpm_bustri4 inst60 (.enabledt(inst3_eq14), .data(inst59_time), .tridata(TIME_COM));
  lpm_bustri4 inst64 (.enabledt(inst3_eq15), .data(inst63_time), .tridata(TIME_COM));
  lpm_or19 inst27 (
    .data0(mov_1_write_all_adr), .data1(jmp_write_ar_all), .data2(jbz_write_ar_all), .result(CONTROL[6]));
  lpm_or11 inst33 (
    .data0(mov_2_write_ar_r), .data1(mov_3_write_ar_r), .data2(push_write_ar_r), .data3(pop_write_ar_r),
    .data4(addc_1_write_ar_r_2), .data5(addc_1_write_ar_r_1), .data6(xor_1_write_ar_r_2),
    .data7(xor_1_write_ar_r_1), .data8(nand_1_write_ar_r_2), .data9(nand_1_write_ar_r_1),
    .data10(sla_1_write_ar_r_2), .data11(sla_1_write_ar_r_1), .data12(addc_2_write_ar_r),
    .data13(xor_2_write_ar_r), .result(CONTROL[15]));
  assign CONTROL[7] = mov_1_read_reg;  // WIRE inst18
  lpm_or12 inst34 (
    .data0(mov_2_write_ar_1), .data1(mov_3_write_ar_1), .data2(addc_2_write_ar_1), .data3(xor_2_write_ar_1),
    .result(CONTROL[16]));
  lpm_add_sub5 inst15 (.dataa(IP_IN), .result(IP_OUT));
  lpm_or14 inst38 (
    .data0(mov_1_read_reg), .data1(push_read_gpr), .data2(addc_1_read_gpr_1), .data3(addc_1_read_gpr_2),
    .data4(xor_1_read_gpr_1), .data5(xor_1_read_gpr_2), .data6(nand_1_read_gpr_1), .data7(nand_1_read_gpr_2),
    .data8(sla_1_read_gpr_1), .data9(sla_1_read_gpr_2), .data10(addc_2_read_gpr), .data11(xor_2_read_gpr),
    .result(CONTROL[8]));
  lpm_or5 inst7 (
    .data0(mov_2_write_ar_all), .data1(mov_3_write_ar_all), .data2(addc_2_write_ar_all),
    .data3(xor_2_write_ar_all), .result(CONTROL[17]));
  lpm_or13 inst35 (
    .data0(mov_3_write_ar_all_2), .data1(addc_2_write_ar_all_2), .data2(xor_2_write_ar_all_2),
    .result(CONTROL[20]));
  lpm_or7 inst14 (
    .data0(mov_2_write_grp), .data1(mov_3_write_gpr), .data2(push_read_gpr), .data3(pop_write_gpr),
    .data4(addc_1_read_gpr_1), .data5(addc_1_read_gpr_2), .data6(addc_1_write_dpr), .data7(xor_1_read_gpr_1),
    .data8(xor_1_read_gpr_2), .data9(xor_1_write_dpr), .data10(nand_1_read_gpr_1),
    .data11(nand_1_read_gpr_2), .data12(nand_1_write_gpr), .data13(sla_1_read_gpr_1),
    .data14(sla_1_read_gpr_2), .data15(sla_1_write_gpr), .data16(addc_2_read_gpr), .data17(addc_2_write_gpr),
    .data18(xor_2_read_gpr), .data19(xor_2_write_gpr), .result(CONTROL[18]));
  lpm_or15 inst39 (.data0(push), .data1(pop), .result(CONTROL[21]));
  lpm_or8 inst28 (
    .data0(mov_2_write_grp), .data1(mov_3_write_gpr), .data2(pop_write_gpr), .data3(addc_1_write_dpr),
    .data4(xor_1_write_dpr), .data5(nand_1_write_gpr), .data6(sla_1_write_gpr), .data7(addc_2_write_gpr),
    .data8(xor_2_write_gpr), .result(CONTROL[19]));
  lpm_or17 inst19 (.data0(jmp_write_ip), .result(CONTROL[23]));
  lpm_or16 inst40 (.data0(pop), .result(CONTROL[22]));
  lpm_or20 inst46 (.data0(jbz_write_ip), .result(CONTROL[24]));
  lpm_or21 inst49 (
    .data0(addc_1_write_ar_r_2), .data1(xor_1_write_ar_r_2), .data2(nand_1_write_ar_r_2),
    .data3(sla_1_write_ar_r_2), .result(CONTROL[25]));
  lpm_or24 inst52 (
    .data0(addc_1_open_gpr_me), .data1(xor_1_open_gpr_me), .data2(nand_1_open_gpr_me),
    .data3(sla_1_open_gpr_me), .data4(addc_2_open_gpr_me), .data5(xor_2_open_gpr_me), .result(CONTROL[27]));
  lpm_or25 inst53 (
    .data0(addc_1_enable_alu), .data1(xor_1_enable_alu), .data2(nand_1_enable_alu), .data3(sla_1_enable_alu),
    .data4(addc_2_enable_alu), .data5(xor_2_enable_alu), .result(CONTROL[26]));
  lpm_or26 inst17 (.data0(addc_2_write_dr_me), .data1(xor_2_write_dr_me), .result(CONTROL[28]));

  assign E = COMMAND_IN;
endmodule
